# Altium schematic sheet Sheet2.SchDoc
size A; SheetNumber: 1; SheetTotal: 1
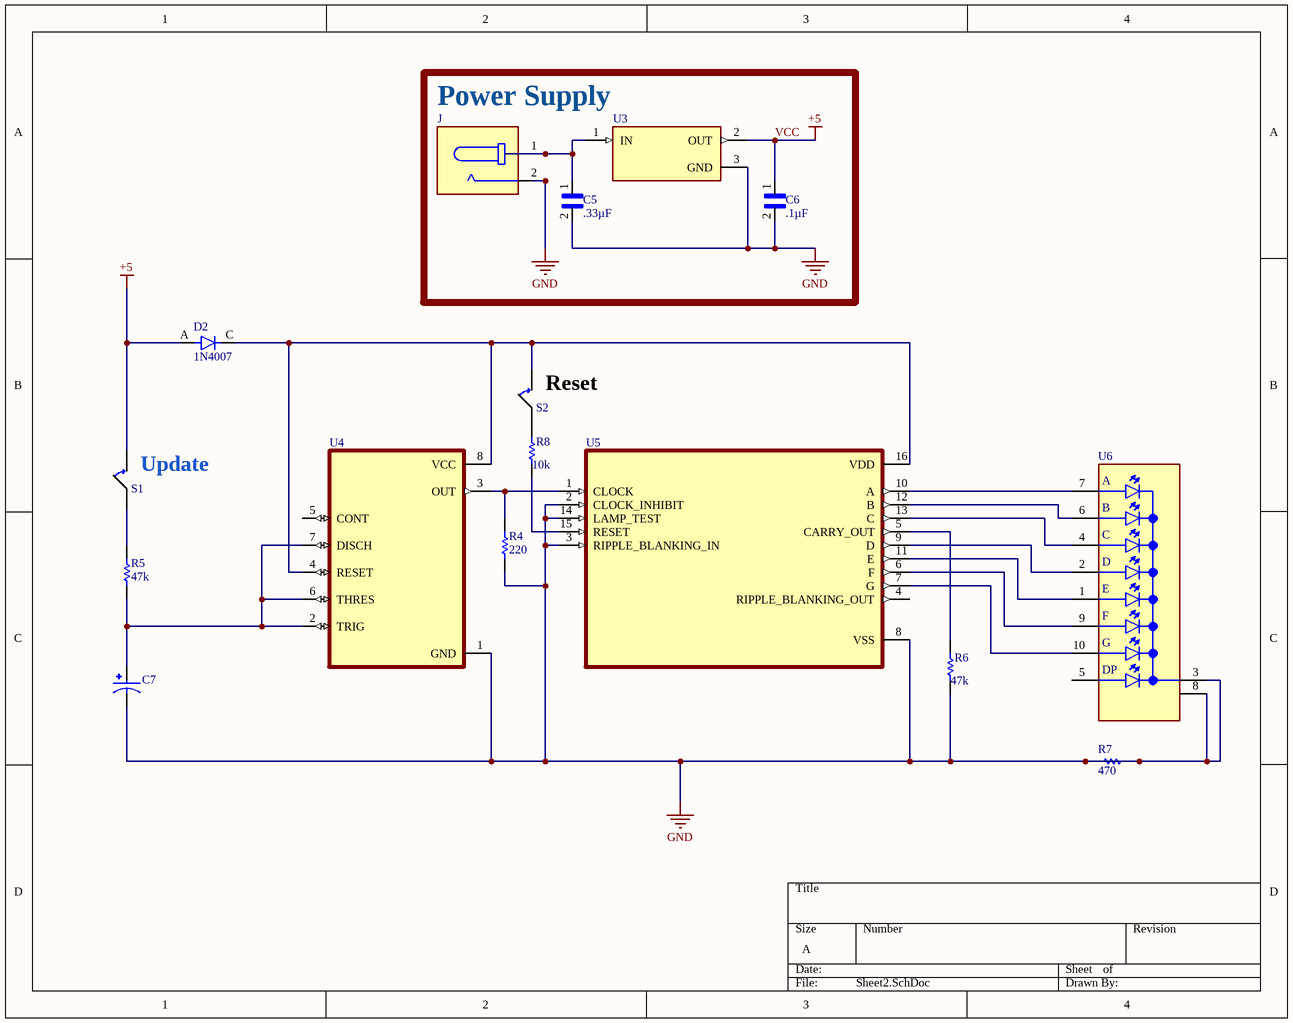
[diagram p0: Sheet2.SchDoc]

## Parts
C5  .33µF  [CAPC3216X190N]
C6  .1µF  [CAPC3216X190N]
C7  EEUED2G100  [CAPPRD500W60D1000H2000]  (value not drawn)
D2  1N4007  [DIOAD1060W80L520D270]
J  PJ-037AH  [CUI_PJ-037AH]  (value not drawn)
R4  value 220  [RES_ERJS03F1001V]  (hidden comment: Resistor)
R5  value 47k  [RES_ERJS03F1001V]  (hidden comment: Resistor)
R6  value 47k  [RES_ERJS03F1001V]  (hidden comment: Resistor)
R7  value 470  [RES_ERJS03F1001V]  (hidden comment: Resistor)
R8  value 10k  [RES_ERJS03F1001V]  (hidden comment: Resistor)
S1  Button Tactile Switch, NO 0.05 A 0.8mm  [Button8014X17N]  (value not drawn)
S2  Button Tactile Switch, NO 0.05 A 0.8mm  [Button8014X17N]  (value not drawn)
U3  7805CD2T  [TO254P1542X460-3N]  (value not drawn)
U4  NE555PW  [SOP65P640X120-8N]  (value not drawn)
U5  CD4033BE  [DIP794W45P254L1969H508Q16]  (value not drawn)
U6  LDSC512RI  [LED_LDSC512RI]  (value not drawn)

## Blocks framed on the sheet
Power Supply: C5 C6 J U3

## Nets
GND: C5.2 C6.2 C7.N J.2 R4.1 R6.1 R7.1 R7.2 U3.3(GND) U4.1(GND) U5.2(CLOCK_INHIBIT) U5.3(RIPPLE_BLANKING_IN) U5.8(VSS) U5.14(LAMP_TEST) U6.3(CC) U6.8(CC)
VCC: C6.1 D2.A S1.1 U3.2(OUT)  [also labelled +5]
NetC5_1: C5.1 J.1 U3.1(IN)
NetC7_P: C7.P R5.1 U4.2(TRIG) U4.6(THRES) U4.7(DISCH)
NetD2_C: D2.C S2.1 U4.4(RESET) U4.8(VCC) U5.16(VDD)
NetR4_2: R4.2 U4.3(OUT) U5.1(CLOCK)
NetR5_2: R5.2 S1.1
NetR6_2: R6.2 U5.5(CARRY_OUT)
NetR8_1: R8.1 U5.15(RESET)
NetU5_6: U5.6(F) U6.9(F)
NetU5_7: U5.7(G) U6.10(G)
NetU5_9: U5.9(D) U6.2(D)
NetU5_10: U5.10(A) U6.7(A)
NetU5_11: U5.11(E) U6.1(E)
NetU5_12: U5.12(B) U6.6(B)
NetU5_13: U5.13(C) U6.4(C)

Not connected (* = marked no-connect by the designer): R8 2; U4 5(CONT); U5 4(RIPPLE_BLANKING_OUT); U6 5(DP)

## Notes on the sheet
- (near S2) Reset
- (near S1) Update

## Library data of the parts
C5 C6 = GRM31CR60J227ME11L: SMD Multilayer Ceramic Capacitor, GRM Series, 220 F, 20%, X5R, 6.3 V, 1206 [3216 Metric]; MF: Murata Electronics; Digi-Key_Part_Number: 490-13970-1-ND; Package: 3216 Murata; MP: GRM31CR60J227ME11L; SnapEDA_Link: https://www.snapeda.com/parts/GRM31CR60J227ME11L/Murata%20Electronics%20North%20America/view-part/1756709/?ref=snap; Purchase-URL: https://pricing.snapeda.com/search/part/GRM31CR60J227ME11L/?ref=eda; Check_prices: https://www.snapeda.com/parts/GRM31CR60J227ME11L/Murata%20Electronics%20North%20America/view-part/1756709/?ref=eda; Value: *
C7 = EEUED2G100: 10F 400V Aluminum Electrolytic Capacitors Radial, Can 8000 Hrs @ 105C; MF: Panasonic Electronic; MP: EEU-ED2G100; SnapEDA_Link: https://www.snapeda.com/parts/EEU-ED2G100/Panasonic+Electronic+Components/view-part/?ref=snap; Package: RADIAL-2 Panasonic; Value: *; Check_prices: https://www.snapeda.com/parts/EEU-ED2G100/Panasonic+Electronic+Components/view-part/?ref=eda
D2 = 1N4007: Diode Standard 1000 V 1A Through Hole DO-41; MF: NTE Electronics, Inc.; Package: DO-41 NTE Electronics; Check_prices: https://www.snapeda.com/parts/1N4007/NTE+Electronics/view-part/?ref=eda; Value: *; Purchase-URL: https://pricing.snapeda.com/search/part/1N4007/?ref=eda; Availability: In Stock; SnapEDA_Link: https://www.snapeda.com/parts/1N4007/NTE+Electronics/view-part/?ref=snap; MP: 1N4007; Price: None
J = PJ-037AH: 2.0 x 6.5 mm, 5.0 A, Horizontal, Through Hole, Dc Power Jack Connector; MF: CUI Devices; SnapEDA_Link: https://www.snapeda.com/parts/PJ-037AH/CUI+Devices/view-part/?ref=snap; Package: None; Value: *; CUI_purchase_URL: https://www.cuidevices.com/product/interconnect/connectors/dc-power-connectors/jacks/pj-037ah?utm_source=snapeda.com&utm_medium=referral&utm_campaign=snapedaBOM; MP: PJ-037AH; Check_prices: https://www.snapeda.com/parts/PJ-037AH/CUI+Devices/view-part/?ref=eda
R4-R8 = Resistor: TC1: 0; SimulationGenericComponent: True; TC2: 0
S1 S2 = Button Tactile Switch, NO 0.05 A 0.8mm: Manufacturer: C & K; Manufacturer Part No.: B3F1000; State: Normaly Open; Date Created: 25 February 2015; Creator: R Kanjee; RS Stock No.: 516-255
U3 = 7805CD2T: Linear Voltage Regulator IC Positive Fixed 1 Output 1.5A D2PAK; MF: STMicroelectronics; SnapEDA_Link: https://www.snapeda.com/parts/7805CD2T/STMicroelectronics/view-part/?ref=snap; Package: D2PAK STMicroelectronics; Value: *; MP: 7805CD2T; Check_prices: https://www.snapeda.com/parts/7805CD2T/STMicroelectronics/view-part/?ref=eda
U4 = NE555PW: Single Precision Timer 8-TSSOP 0 to 70; MF: Texas Instruments; Purchase-URL: https://pricing.snapeda.com/search/part/NE555PW/?ref=eda; Package: TSSOP-8 Texas Instruments; MP: NE555PW; Value: *; SnapEDA_Link: https://www.snapeda.com/parts/NE555PW/Texas+Instruments/view-part/?ref=snap; Availability: In Stock; Price: None; Check_prices: https://www.snapeda.com/parts/NE555PW/Texas+Instruments/view-part/?ref=eda
U5 = CD4033BE: CMOS Decade Counter/Divider with Decoded 7-Segment Display Outputs and Ripple Blanking 16-PDIP -55 to 125; MF: Texas Instruments; MP: CD4033BE; Package: PDIP-16 Texas Instruments; Availability: Good; Purchase-URL: https://pricing.snapeda.com/search/part/CD4033BE/?ref=eda; SnapEDA_Link: https://www.snapeda.com/parts/CD4033BE/Texas%20Instruments/view-part/627730/?ref=snap; Check_prices: https://www.snapeda.com/parts/CD4033BE/Texas%20Instruments/view-part/627730/?ref=eda; Value: *; Price: None
U6 = LDSC512RI: DISPLAY, 7 SEGMENT, 14.2MM, GREEN; LED Colour:Green; Forward Current If:10mA; Forward Voltage:2.2V; Luminous Intensity:3.5mcd; No. of Digits / Alpha:1; Character Size:14.2mm; Common Connection:Common Cathode; Product Range:-; SVHC:No SVHC (27-Jun-2018); MF: Lumex Optoelectronics; SnapEDA_Link: https://www.snapeda.com/parts/LDSC512RI/Lumex/view-part/?ref=snap; Package: DIP-10 Lumex; Value: *; MP: LDSC512RI; Check_prices: https://www.snapeda.com/parts/LDSC512RI/Lumex/view-part/?ref=eda